# Altium project test1.PrjPcb
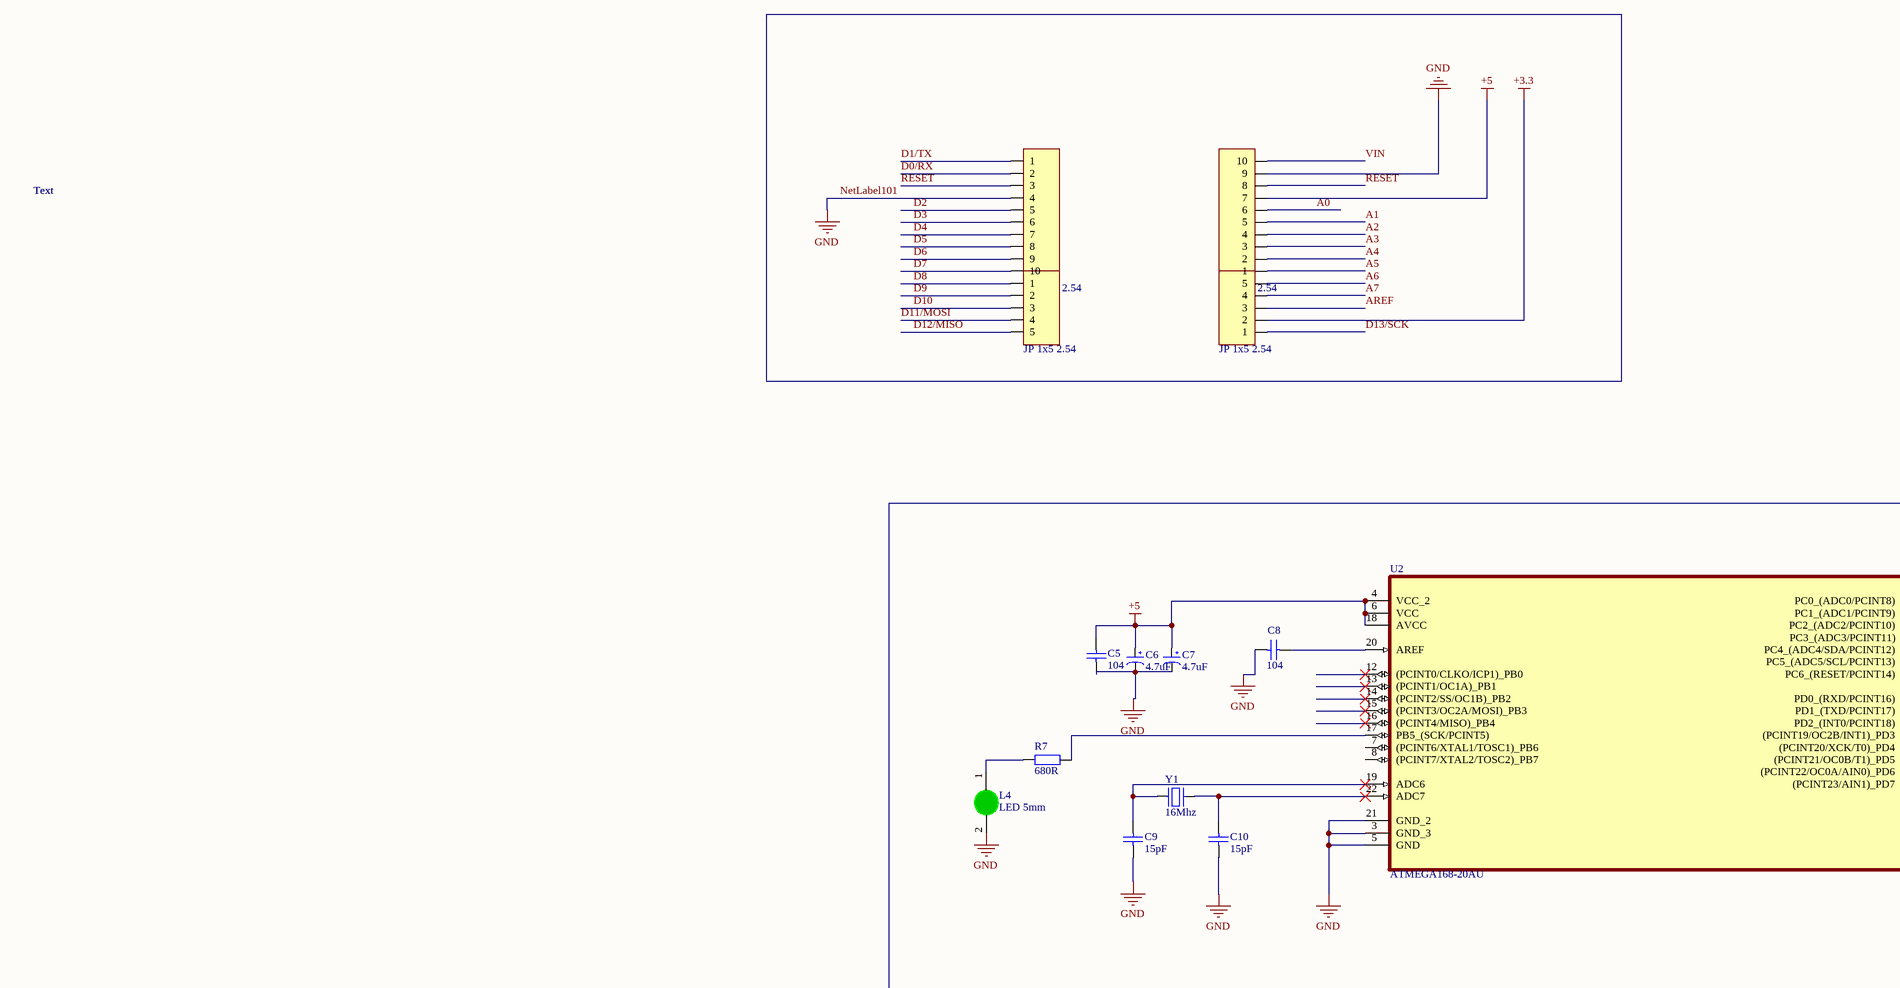
[diagram p0: Sheet1.SchDoc, left]
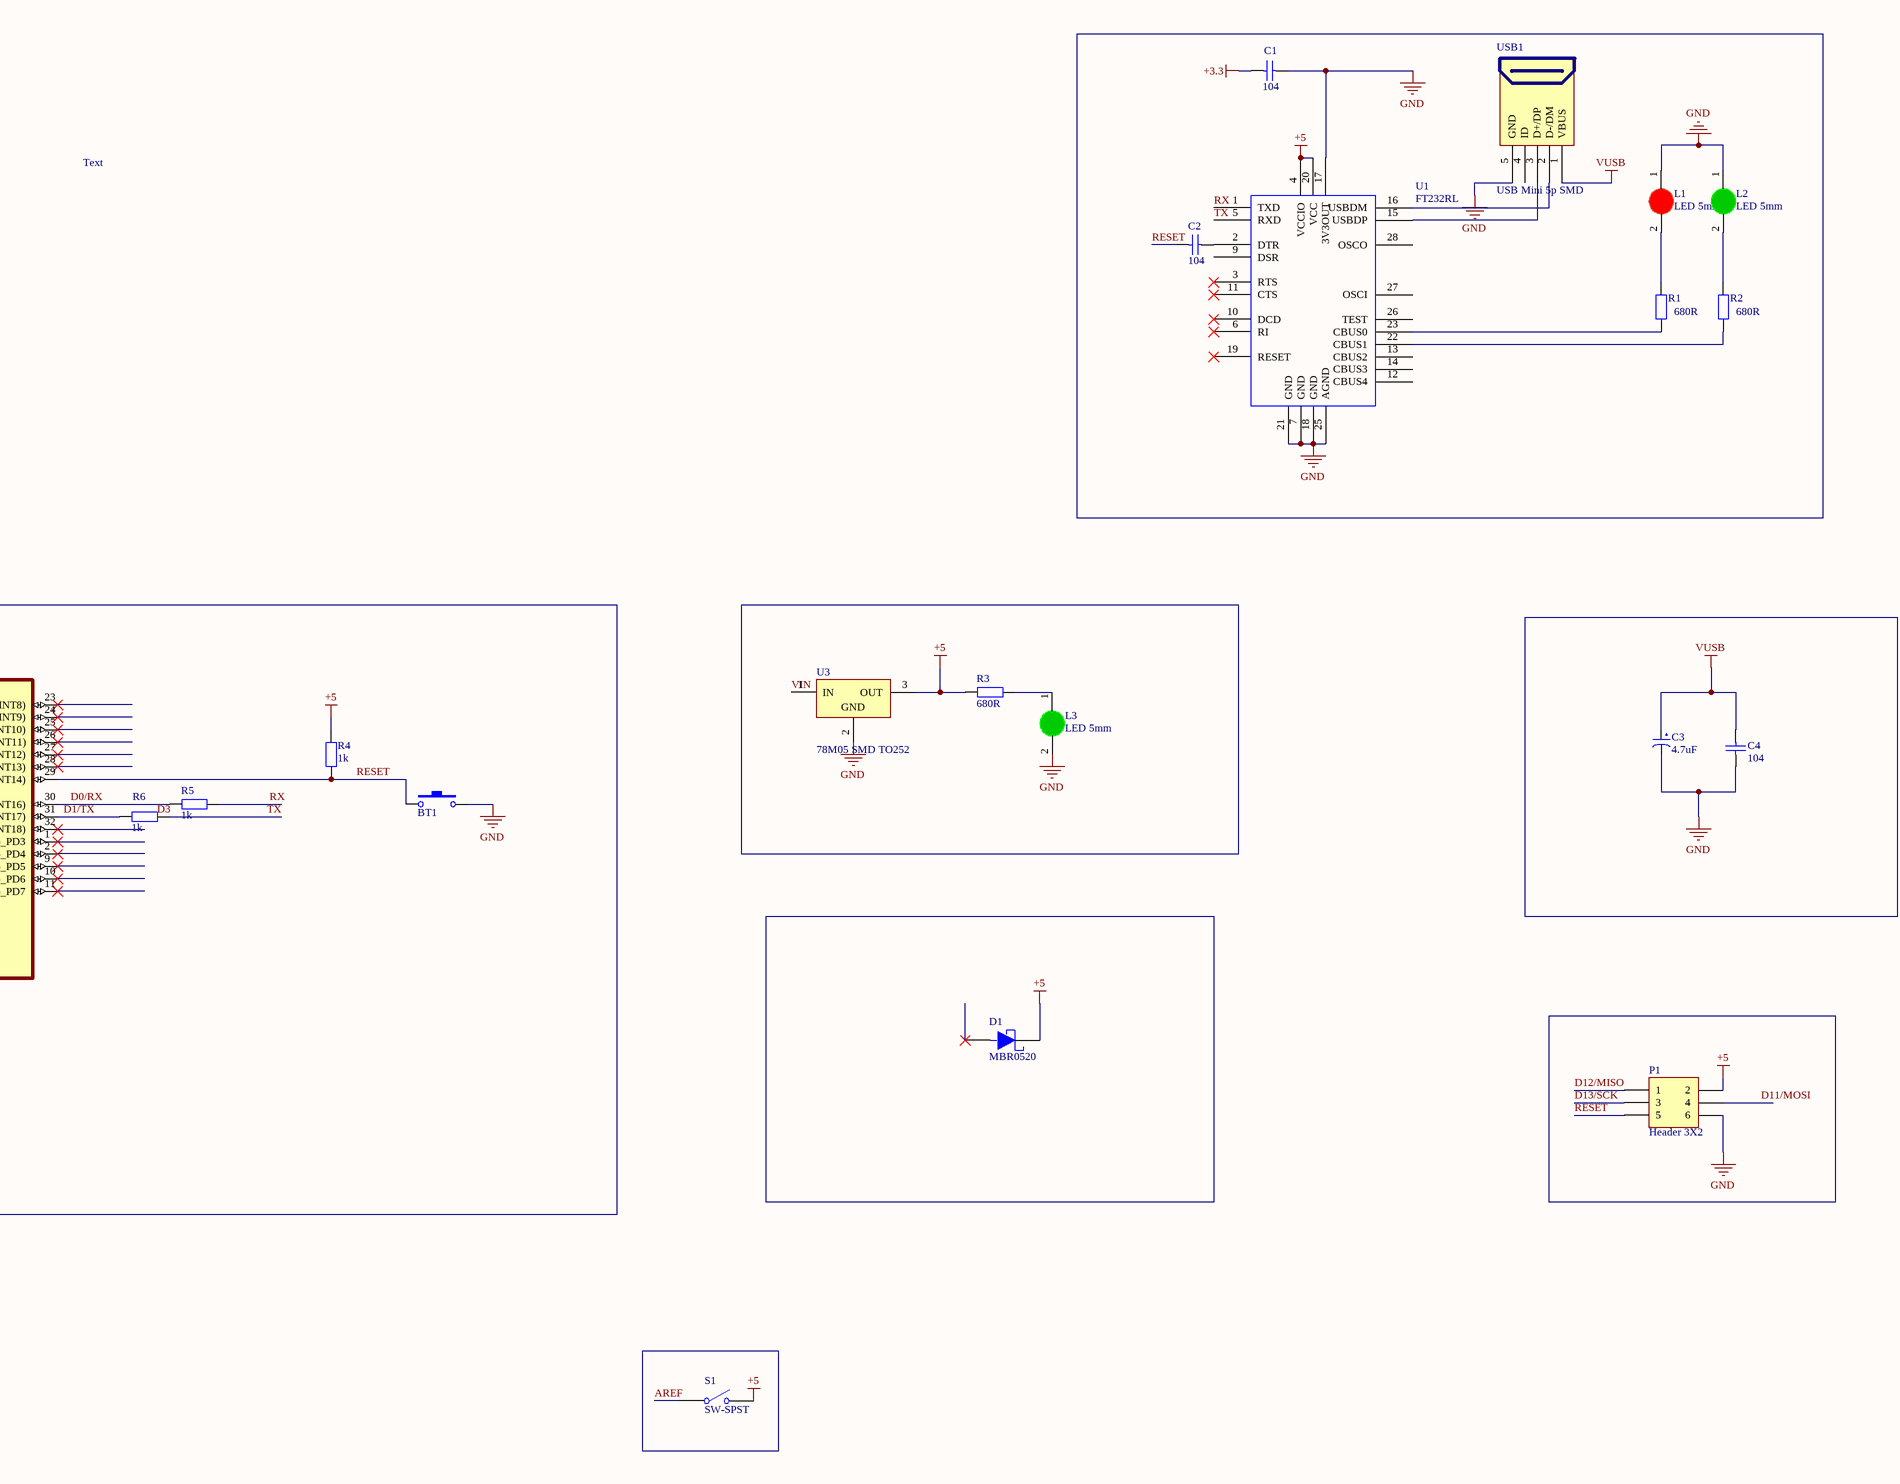
[diagram p1: Sheet1.SchDoc, right]
1 sheet, 34 parts. Net scope: global (net labels, ports and power ports of the same name join across sheets).
Board file: PCB1.PcbDoc

## Sheet Sheet1.SchDoc
size A0; SheetNumber: 1; SheetTotal: 1

### Parts
BT1  Nut Nhan 2 Chan SMD 3x6x2.5  [Nut Nhan 2 Chan SMD 3x6x2.5]  (value not drawn)
C1  104  [tu 0805]
C2  104  [tu 0805]
C3  4.7uF  [tu hoa 5mm]
C4  104  [tu 0805]
C5  104  [tu 0603]
C6  4.7uF  [tu hoa 5mm]
C7  4.7uF  [tu hoa 5mm]
C8  104  [tu 0603]
C9  15pF  [tu 0805]
C10  15pF  [tu 0805]
D1  MBR0520  [SOD-123]
JP1  JP 1x10 2.54  [JP 1x10 DT]
JP2  JP 1x10 2.54  [JP 1x10 DT]
JP3  JP 1x5 2.54  [JP 1x5 DT]
JP4  JP 1x5 2.54  [JP 1x5 DT]
L1  LED 5mm  [LED-5MM-RED]
L2  LED 5mm  [LED-5MM-Green]
L3  LED 5mm  [LED-5MM-Green]
L4  LED 5mm  [LED-5MM-Green]
P1  Header 3X2  [HDR2X3]
R1  680R  [tro smd 0805]
R2  680R  [tro smd 0805]
R3  680R  [tro smd 0805]
R4  1k  [tro smd 0805]
R5  1k  [tro smd 0805]
R6  1k  [tro smd 0805]
R7  680R  [tro smd 0805]
S1  SW-SPST  [SPST-2]
U1  FT232RL  [TSSOP28]
U2  ATMEGA168-20AU  [QFP80P900X900X120-32N]
U3  78M05 SMD TO252  [TO252]
USB1  USB Mini 5p SMD  [USB Mini 5p SMD]
Y1  16Mhz  [Thach Anh 2 Chan 32,768 KHz]

### Nets
+3.3: C1.2 JP4.2
+5: C5.1 C6.1 C7.1 D1.1(CA) JP2.7 P1.2 R3.2 R4.2 S1.2(NO) U1.4(VCCIO) U1.20(VCC) U2.4(VCC_2) U2.6(VCC) U2.18(AVCC) U3.3(OUT)
NetLabel101: BT1.2 C1.1 C3.2 C4.1 C5.2 C6.2 C7.2 C8.2 C9.1 C10.1 JP1.4 JP2.9 L1.1(A) L2.1(A) L3.2(K) L4.2(K) P1.6 U1.7(GND) U1.17(3V3OUT) U1.18(GND) U1.21(GND) U1.25(AGND) U2.3(GND_3) U2.5(GND) U2.21(GND_2) U3.2(GND) USB1.5(GND)  [also labelled GND]
VUSB: C3.1 C4.2 USB1.1(VBUS)
A0: JP2.6
A1: JP2.5
A2: JP2.4
A3: JP2.3
A4: JP2.2
A5: JP2.1
A6: JP4.5
A7: JP4.4
AREF: JP4.3 S1.1(COMMON)
D0/RX: JP1.2 R5.1 U2.30(PD0_(RXD/PCINT16))
D1/TX: JP1.1 R6.1 U2.31(PD1_(TXD/PCINT17))
D2: JP1.5
D3: JP1.6
D4: JP1.7
D5: JP1.8
D6: JP1.9
D7: JP1.10
D8: JP3.1
D9: JP3.2
D10: JP3.3
D11/MOSI: JP3.4 P1.4
D12/MISO: JP3.5 P1.1
D13/SCK: JP4.1 P1.3
RESET: BT1.1 C2.2 JP1.3 JP2.8 P1.5 R4.1 U2.29(PC6_(RESET/PCINT14))
RX: R5.2 U1.1(TXD)
TX: R6.2 U1.5(RXD)
VIN: JP2.10 U3.1(IN)
NetC2_1: C2.1 U1.2(DTR)
NetC8_1: C8.1 U2.20(AREF)
NetC9_2: C9.2 U2.19(ADC6) Y1.1
NetC10_2: C10.2 U2.22(ADC7) Y1.2
NetL1_2: L1.2(K) R1.1
NetL2_2: L2.2(K) R2.1
NetL3_1: L3.1(A) R3.1
NetL4_1: L4.1(A) R7.2
NetR1_2: R1.2 U1.23(CBUS0)
NetR2_2: R2.2 U1.22(CBUS1)
NetR7_1: R7.1 U2.17(PB5_(SCK/PCINT5))
NetU1_15: U1.15(USBDP) USB1.3(D+/DP)
NetU1_16: U1.16(USBDM) USB1.2(D-/DM)

Not connected (* = marked no-connect by the designer): D1 2(AN)*; U1 3(RTS)* 6(RI)* 9(DSR) 10(DCD)* 11(CTS)* 12(CBUS4) 13(CBUS2) 14(CBUS3) 19(RESET)* 26(TEST) 27(OSCI) 28(OSCO); U2 1((PCINT19/OC2B/INT1)_PD3)* 2((PCINT20/XCK/T0)_PD4)* 7((PCINT6/XTAL1/TOSC1)_PB6) 8((PCINT7/XTAL2/TOSC2)_PB7) 9((PCINT21/OC0B/T1)_PD5)* 10((PCINT22/OC0A/AIN0)_PD6)* 11((PCINT23/AIN1)_PD7)* 12((PCINT0/CLKO/ICP1)_PB0)* 13((PCINT1/OC1A)_PB1)* 14((PCINT2/SS/OC1B)_PB2)* 15((PCINT3/OC2A/MOSI)_PB3)* 16((PCINT4/MISO)_PB4)* 23(PC0_(ADC0/PCINT8))* 24(PC1_(ADC1/PCINT9))* 25(PC2_(ADC2/PCINT10))* 26(PC3_(ADC3/PCINT11))* 27(PC4_(ADC4/SDA/PCINT12))* 28(PC5_(ADC5/SCL/PCINT13))* 32(PD2_(INT0/PCINT18))*; USB1 4(ID)

### Notes on the sheet
- Text
- Labels drawn without touching a wire or pin: D3

### Library data of the parts
BT1 = Nut Nhan 2 Chan SMD 3x6x2.5: Ma_Hang: MH001036; Ten: Nút Nhấn 2 Chân 3x6x2.5MM SMD
C1 C2 C4 = Tu 0805 104 50V 10%: Dán; Don_Vi: Con; So_Chan: 2; Ten_Linh_Kien: Tụ 0805 104-100nF 10% 50V; Ma_Hang: MH004551; Chung_Loai: Dán; Kieu_Chan: *
C3 C6 C7 = Tu Hoa 4.7uF 50V 5x11: Cắm; Don_Vi: Con; So_Chan: 2; Ten_Linh_Kien: Tụ Hóa 4.7uF 50V 5x11MM; Ma_Hang: MH001357; Chung_Loai: Cắm; Kieu_Chan: *
C5 C8 = Tu 0603 104 50V 10%: Dán; Don_Vi: Con; So_Chan: 2; Ten_Linh_Kien: Tụ 0603 104-100nF 10% 50V; Ma_Hang: MH004568; Chung_Loai: Dán; Kieu_Chan: *
C9 C10 = Tu 0805 15pF 50V 10%: Dán; Don_Vi: Con; So_Chan: 2; Ten_Linh_Kien: Tụ 0805 15P 10% 50V; Ma_Hang: MH004556; Chung_Loai: Dán; Kieu_Chan: *
D1 = MBR0520: Diode Schottky 20V 500mA Surface Mount SOD-123; MF: ON Semiconductor; Package: SOD-123 International Rectifier; Price: None; SnapEDA_Link: https://www.snapeda.com/parts/MBR0520/ON%20Semiconductor/view-part/564242/?ref=snap; Availability: Unavailable; Value: *; MP: MBR0520
JP1 JP2 = JP 1x10 2.54 Duc Thang: Cắm; Ten_Linh_Kien: Jump Đơn Đực 2.54MM 1x40P Thẳng 11MM; Don_Vi: Con; Ma_Hang: MH000903; Ghi_Chu: *; Kieu_Chan: *; Chung_Loai: Cắm
JP3 JP4 = JP 1x5 2.54 Duc Thang: Cắm; Ten_Linh_Kien: Jump Đơn Đực 2.54MM 1x40P Thẳng 11MM; Don_Vi: Con; Ma_Hang: MH000903; Ghi_Chu: *; Kieu_Chan: *; Chung_Loai: Cắm
L1 = LED 5mm Do: Cắm; Don_Vi: Con; Ma_Hang: MH008967; Ten_Linh_Kien: Led 5MM Phủ Đỏ (1000c); Ghi_Chu: *; Kieu_Chan: *; Chung_Loai: Cắm
L2-L4 = LED 5mm Xanh La: Cắm; Don_Vi: Con; Ma_Hang: MH008969; Ten_Linh_Kien: LED 5MM Phủ Xanh (1000c); Ghi_Chu: *; Kieu_Chan: *; Chung_Loai: Cắm
P1 = Header 3X2: Header, 3-Pin, Dual row; LatestRevisionDate: 17-Jul-2002; LatestRevisionNote: Re-released for DXP Platform.; Publisher: Altium Limited
R1-R3 R7 = Tro 0805 1% 680R: Dán; Don_Vi: Con; So_Chan: 2; Ten_Linh_Kien: Trở 0805 1% 680R; Ma_Hang: MH005487; Chung_Loai: Dán; Kieu_Chan: *
R4-R6 = Tro 0805 1% 1k: Dán; Don_Vi: Con; So_Chan: 2; Ten_Linh_Kien: Trở 0805 1% 1k; Ma_Hang: MH005468; Chung_Loai: Dán; Kieu_Chan: *
S1 = SW-SPST: Single-Pole, Single-Throw Switch; Published: 24-Mar-1999; LatestRevisionDate: 17-Jul-2002; LatestRevisionNote: Re-released for DXP Platform.; PackageReference: SPST-2; Publisher: Altium Limited; PackageDescription: Switch; 2 Leads
U1 = FT232RL: USB TO UART INTERFACE; Manufacturer: FTDI, Future Technology Devices International Ltd; Manufacturer Part Number: FT232RL R; Number of Channels: 8; Voltage: 3.3 V ~ 5.25 V; FIFO's: 256 Byte; Supplier 1: Digi-Key; Supplier Part Number 1: 768-1007-2-ND; RoHS: RoHS Compliant; Features: Serial Interface; Package / Case: 28-SSOP; Supplier: Digi-Key; Packaging: Tape & Reel (TR); Supplier Part Number: 768-1007-2-ND; Category: Integrated Circuits (ICs)
U2 = ATMEGA168-20AU: AVR AVRÂ® ATmega Microcontroller IC 8-Bit 20MHz 16KB _8K x 16_ FLASH 32-TQFP _7x7_; MF: Microchip; MP: ATMEGA168-20AU; Availability: Unavailable; Package: TQFP-32 Microchip; Price: None; SnapEDA_Link: https://www.snapeda.com/parts/ATMEGA168-20AU/Microchip/view-part/776709/?ref=snap; Value: *
U3 = 78M05 SMD TO252: Dán; Don_Vi: Con; Ten_Linh_Kien: 78M05 TO252; Ma_Hang: MH001917; Ghi_Chu: *; Kieu_Chan: *; Chung_Loai: Dán
USB1 = USB Mini 5p SMD: USB Type B; Ten: MiniUSB 5P SMD; Ma_Hang: MH001022
Y1 = Thach Anh 2 chan 32,768 Khz: Crystal For all Crystal 2pin.; Value: 4Mhz